# EAGLE schematic main (EAGLE 7.5.0)
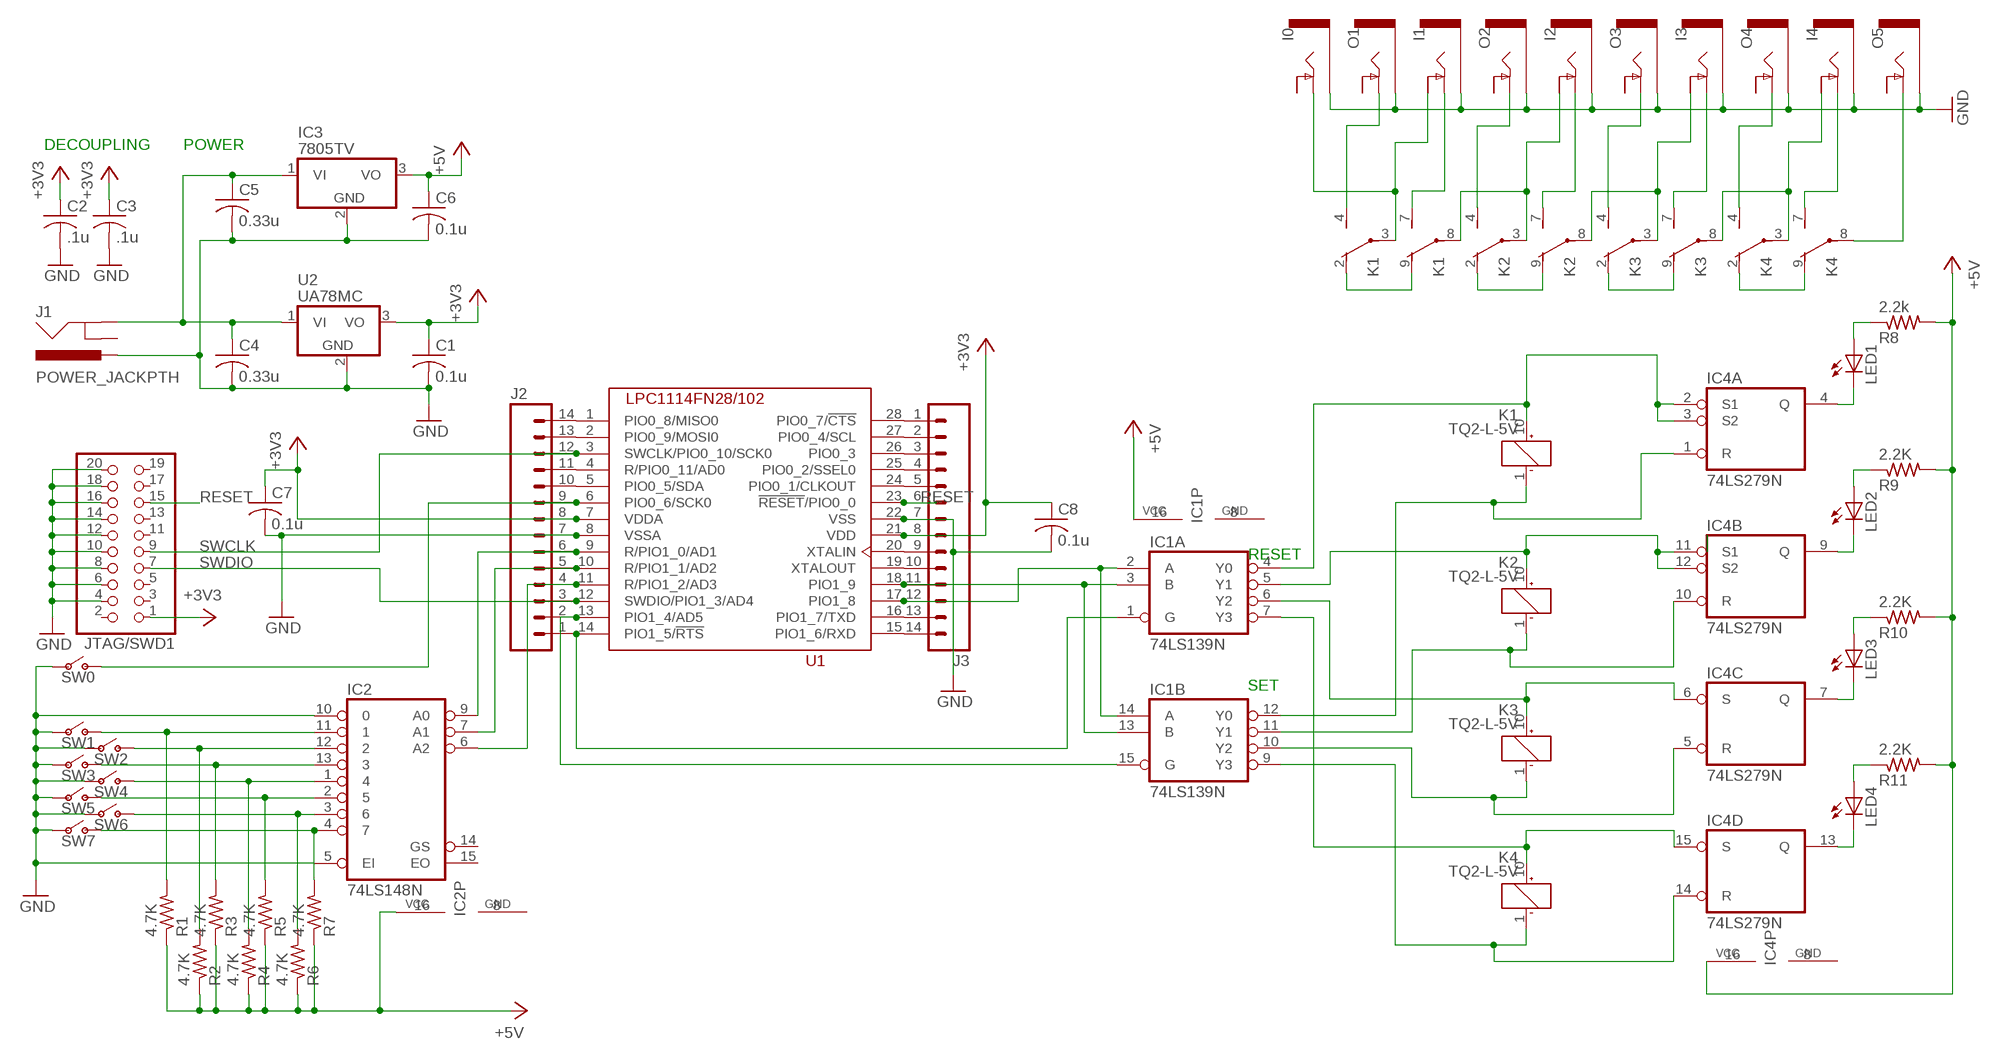
[diagram p0: schematic, sheet 1]

## Parts
C1  0.1u  C-US050-024X044  [C050-024X044]
C2  .1u  C-US050-024X044  [C050-024X044]
C3  .1u  C-US050-024X044  [C050-024X044]
C4  0.33u  C-US050-024X044  [C050-024X044]
C5  0.33u  C-US050-024X044  [C050-024X044]
C6  0.1u  C-US050-024X044  [C050-024X044]
C7  0.1u  C-US050-024X044  [C050-024X044]
C8  0.1u  C-US050-024X044  [C050-024X044]
I0  AUDIO-JACK-NORM-TS  [AUDIO-JACK-.25-INCH-SWCRAFT]
I1  AUDIO-JACK-NORM-TS  [AUDIO-JACK-.25-INCH-SWCRAFT]
I2  AUDIO-JACK-NORM-TS  [AUDIO-JACK-.25-INCH-SWCRAFT]
I3  AUDIO-JACK-NORM-TS  [AUDIO-JACK-.25-INCH-SWCRAFT]
I4  AUDIO-JACK-NORM-TS  [AUDIO-JACK-.25-INCH-SWCRAFT]
IC1  74LS139N  [DIL16]
IC2  74LS148N  [DIL16]
IC3  7805TV  [TO220V]
IC4  74LS279N  [DIL16]
J1  POWER_JACKPTH  [POWER_JACK_PTH]
J2  M14  [1X14]
J3  M14  [1X14]
JTAG/SWD1  PINHD-2X10  [2X10]
K1  TQ2-L-5V  [TQ2]
K2  TQ2-L-5V  [TQ2]
K3  TQ2-L-5V  [TQ2]
K4  TQ2-L-5V  [TQ2]
LED1  LED5MM  [LED5MM]
LED2  LED5MM  [LED5MM]
LED3  LED5MM  [LED5MM]
LED4  LED5MM  [LED5MM]
O1  AUDIO-JACK-NORM-TS  [AUDIO-JACK-.25-INCH-SWCRAFT]
O2  AUDIO-JACK-NORM-TS  [AUDIO-JACK-.25-INCH-SWCRAFT]
O3  AUDIO-JACK-NORM-TS  [AUDIO-JACK-.25-INCH-SWCRAFT]
O4  AUDIO-JACK-NORM-TS  [AUDIO-JACK-.25-INCH-SWCRAFT]
O5  AUDIO-JACK-NORM-TS  [AUDIO-JACK-.25-INCH-SWCRAFT]
R1  4.7K  R-US_0204/7  [0204/7]
R2  4.7K  R-US_0204/7  [0204/7]
R3  4.7K  R-US_0204/7  [0204/7]
R4  4.7K  R-US_0204/7  [0204/7]
R5  4.7K  R-US_0204/7  [0204/7]
R6  4.7K  R-US_0204/7  [0204/7]
R7  4.7K  R-US_0204/7  [0204/7]
R8  2.2k  R-US_0204/7  [0204/7]
R9  2.2K  R-US_0204/7  [0204/7]
R10  2.2K  R-US_0204/7  [0204/7]
R11  2.2K  R-US_0204/7  [0204/7]
SW0  SWITCH-SPST  [SWITCH_SPST_OFFBOARD]
SW1  SWITCH-SPST  [SWITCH_SPST_OFFBOARD]
SW2  SWITCH-SPST  [SWITCH_SPST_OFFBOARD]
SW3  SWITCH-SPST  [SWITCH_SPST_OFFBOARD]
SW4  SWITCH-SPST  [SWITCH_SPST_OFFBOARD]
SW5  SWITCH-SPST  [SWITCH_SPST_OFFBOARD]
SW6  SWITCH-SPST  [SWITCH_SPST_OFFBOARD]
SW7  SWITCH-SPST  [SWITCH_SPST_OFFBOARD]
U1  LPC1114FN28/102  [DIL28-6]
U2  UA78MC  [TO220V]

## Nets
+3V3: C1.1 C2.1 C3.1 C7.1 C8.1 J2.8 J3.8 JTAG/SWD1.1 U1.7(VDDA) U1.21(VDD) U2.3(VO)
+5V: C6.1 IC1.16(P:VCC) IC2.16(VCC) IC3.3(VO) IC4.16(P:VCC) R1.1 R2.1 R3.1 R4.1 R5.1 R6.1 R7.1 R8.2 R9.2 R10.2 R11.2
GND: C1.2 C2.2 C3.2 C4.2 C5.2 C6.2 C7.2 C8.2 I0.S I1.S I2.S I3.S I4.S IC2.5(EI) IC2.10 IC3.2(GND) J1.PWR J2.7 J3.7 JTAG/SWD1.4 JTAG/SWD1.6 JTAG/SWD1.8 JTAG/SWD1.10 JTAG/SWD1.12 JTAG/SWD1.14 JTAG/SWD1.16 JTAG/SWD1.18 JTAG/SWD1.20 O1.S O2.S O3.S O4.S O5.S SW0.3 SW1.3 SW2.3 SW3.3 SW4.3 SW5.3 SW6.3 SW7.3 U1.8(VSSA) U1.22(VSS) U2.2(GND)
N$1: J3.14 U1.15(PIO1_6/RXD)
N$2: C4.1 C5.1 IC3.1(VI) J1.GND U2.1(VI)
N$3: J3.13 U1.16(PIO1_7/TXD)
N$4: IC2.11 R1.2 SW1.2
N$5: IC1.3(A:B) IC1.13(B:B) J3.11 U1.18(PIO1_9)
N$6: IC1.15(B:G) J2.2 U1.13(PIO1_4/AD5)
N$7: IC1.1(A:G) J2.1 U1.14(PIO1_5/!RTS)
N$8: IC1.10(B:Y2) IC4.5(C:R) K3.1(_:-)
N$9: IC1.4(A:Y0) IC4.2(A:S1) IC4.3(A:S2) K1.10(_:+)
N$10: IC1.5(A:Y1) IC4.11(B:S1) IC4.12(B:S2) K2.10(_:+)
N$11: IC1.11(B:Y1) IC4.10(B:R) K2.1(_:-)
N$12: IC1.6(A:Y2) IC4.6(C:S) K3.10(_:+)
N$14: IC1.7(A:Y3) IC4.15(D:S) K4.10(_:+)
N$15: IC1.9(B:Y3) IC4.14(D:R) K4.1(_:-)
N$16: IC1.12(B:Y0) IC4.1(A:R) K1.1(_:-)
N$17: IC4.4(A:Q) LED1.K(C)
N$18: IC4.9(B:Q) LED2.K(C)
N$19: IC4.7(C:Q) LED3.K(C)
N$20: IC4.13(D:Q) LED4.K(C)
N$21: LED1.A R8.1
N$22: LED2.A R9.1
N$23: LED3.A R10.1
N$24: LED4.A R11.1
N$25: IC1.2(A:A) IC1.14(B:A) J3.12 U1.17(PIO1_8)
N$26: IC2.12 R2.2 SW2.2
N$27: IC2.13 R3.2 SW3.2
N$28: IC2.1 R4.2 SW4.2
N$29: IC2.2 R5.2 SW5.2
N$30: IC2.3 R6.2 SW6.2
N$31: IC2.4 R7.2 SW7.2
N$32: I0.T I1.TS K1.3(1:P)
N$33: K1.2(1:O) K1.9(2:O)
N$34: I1.T K1.7(2:S)
N$35: K1.4(1:S) O1.T
N$36: I2.TS K1.8(2:P) K2.3(1:P)
N$37: K2.2(1:O) K2.9(2:O)
N$38: K2.4(1:S) O2.T
N$39: I2.T K2.7(2:S)
N$40: I3.TS K2.8(2:P) K3.3(1:P)
N$41: K3.4(1:S) O3.T
N$42: K3.2(1:O) K3.9(2:O)
N$43: I3.T K3.7(2:S)
N$44: IC2.9(A0) J2.6 U1.9(R/PIO1_0/AD1)
N$45: I4.TS K3.8(2:P) K4.3(1:P)
N$46: K4.2(1:O) K4.9(2:O)
N$47: K4.4(1:S) O4.T
N$48: I4.T K4.7(2:S)
N$49: IC2.7(A1) J2.5 U1.10(R/PIO1_1/AD2)
N$50: K4.8(2:P) O5.T
N$51: IC2.6(A2) J2.4 U1.11(R/PIO1_2/AD3)
N$52: J2.9 SW0.2 U1.6(PIO0_6/SCK0)
N$53: J2.10 U1.5(PIO0_5/SDA)
N$54: J2.11 U1.4(R/PIO0_11/AD0)
N$55: J2.13 U1.2(PIO0_9/MOSI0)
N$56: J2.14 U1.1(PIO0_8/MISO0)
N$57: J3.1 U1.28(PIO0_7/!CTS)
N$58: J3.2 U1.27(PIO0_4/SCL)
N$59: J3.3 U1.26(PIO0_3)
N$60: J3.4 U1.25(PIO0_2/SSEL0)
N$61: J3.5 U1.24(PIO0_1/CLKOUT)
N$62: J3.9 U1.20(XTALIN)
N$63: J3.10 U1.19(XTALOUT)
RESET: J3.6 JTAG/SWD1.15 U1.23(!RESET!/PIO0_0)
SWCLK: J2.12 JTAG/SWD1.9 U1.3(SWCLK/PIO0_10/SCK0)
SWDIO: J2.3 JTAG/SWD1.7 U1.12(SWDIO/PIO1_3/AD4)
Unconnected: I0.TS IC2.14(GS) IC2.15(EO) J1.GNDBREAK JTAG/SWD1.2 JTAG/SWD1.3 JTAG/SWD1.5 JTAG/SWD1.11 JTAG/SWD1.13 JTAG/SWD1.17 JTAG/SWD1.19 O1.TS O2.TS O3.TS O4.TS O5.TS

## Notes on the sheet
- DECOUPLING | POWER
- RESET
- SET

## Power pins joined to a net without a drawn wire
GND: IC1.8(P:GND) IC2.8(GND) IC4.8(P:GND)

## Library data of the parts
C1-C8 = rcl:C-US: CAPACITOR, American symbol
I0 I1-I4 O1-O5 = SparkFun-Connectors:AUDIO-JACK-NORM-TS: Modeled after Switchcraft RN112APC.
IC1 = 74xx-us:74*139: Dual 2-line to 4-line DECODER/DEMULTIPLEXER
IC2 = 74xx-us:74*148: 10-line to 4-line and 8-line to 3-line PRIORITY ENCODER
IC3 = linear:78*: Positive VOLTAGE REGULATOR Source: http://cache.national.com/ds/LM/LM78L05.pdf http://www.fairchildsemi.com/ds/LM/LM7805.pdf
IC4 = 74xx-us:74*279: Quadruple S-R LATCH
J1 = SparkFun-Connectors:POWER_JACK: Power Jack This is the standard 5.5mm barrel jack for power. The PTH is the most common, proven, reliable, footprint. The Slot footprint only works if the mill layer is transmitted to the PCB fab house so be warned. Mating wall wart : TOL-00298 (and others); PROD_ID: CONN-08197
J2 J3 = SparkFun-Connectors:M14: Header 14 Standard 14-pin 0.1" header. Use with straight break away headers (SKU : PRT-00116), right angle break away headers (PRT-00553), swiss pins (PRT-00743), machine pins (PRT-00117), and female headers (PRT-00115).
JTAG/SWD1 = pinhead:PINHD-2X10: PIN HEADER
K1-K4 = relay:TQ2?*: LOW PROFILE 2 FORM C RELAY NAiS Source: http://www.mew-europe.com/.. en_ds_61020_0001.pdf Source: http://www.mew-europe.com/.. en_ds_61020_0004.pdf; MF: AROMAT/ MATSUSHITA; MPN: TQ2-L-5V; OC_FARNELL: 1448361; OC_NEWARK: 64K3191
LED1-LED4 = led:LED: LED OSRAM: - CHIPLED LG R971, LG N971, LY N971, LG Q971, LY Q971, LO R971, LY R971 LH N974, LH R974 LS Q976, LO Q976, LY Q976 LO Q996 - Hyper CHIPLED LW Q18S LB Q993, LB Q99A, LB R99A - SideLED LS A670, LO A670, LY A670, LG A670, LP A670 LB A673, LV A673, LT A673, LW A673 LH A674 LY A675 LS A676, LA A676, LO A676, LY A676, LW A676 LS A679, LY A679, LG A679 - Hyper Micro SIDELED® LS Y876, LA Y876, LO Y876, LY Y876 LT Y87S - SmartLED LW L88C, LW L88S LB L89C, LB L89S, LG L890 LS L89K, LO L89K, LY L89K LS L896, LA L896, LO L896, LY L896 - TOPLED LS T670, LO T670, LY T670, LG T670, LP T670 LSG T670, LSP T670, LSY T670, LOP T670, LYG T670 LG T671, LOG T671, LSG T671 LB T673, LV T673, LT T673, LW T673 LH T674 LS T676, LA T676, LO T676, LY T676, LB T676, LH T676, LSB T676, LW T676 LB T67C, LV T67C, LT T67C, LS T67K, LO T67K, LY T67K, LW E67C LS E67B, LA E67B, LO E67B, LY E67B, LB E67C, LV E67C, LT E67C LW T67C LS T679, LY T679, LG T679 LS T770, LO T770, LY T770, LG T770, LP T770 LB T773, LV T773, LT T773, LW T773 LH T774 LS E675, LA E675, LY E675, LS T675 LS T776, LA T776, LO T776, LY T776, LB T776 LHGB T686 LT T68C, LB T68C - Hyper Mini TOPLED® LB M676 - Mini TOPLED Santana® LG M470 LS M47K, LO M47K, LY M47K Source: http://www.osram.convergy.de LUXEON: - LUMILED® LXK2-PW12-R00, LXK2-PW12-S00, LXK2-PW14-U00, LXK2-PW14-V00 LXK2-PM12-R00, LXK2-PM12-S00, LXK2-PM14-U00 LXK2-PE12-Q00, LXK2-PE12-R00, LXK2-PE12-S00, LXK2-PE14-T00, LXK2-PE14-U00 LXK2-PB12-K00, LXK2-PB12-L00, LXK2-PB12-M00, LXK2-PB14-N00, LXK2-PB14-P00, LXK2-PB14-Q00 LXK2-PR12-L00, LXK2-PR12-M00, LXK2-PR14-Q00, LXK2-PR14-R00 LXK2-PD12-Q00, LXK2-PD12-R00, LXK2-PD12-S00 LXK2-PH12-R00, LXK2-PH12-S00 LXK2-PL12-P00, LXK2-PL12-Q00, LXK2-PL12-R00 Source: www.luxeon.com KINGBRIGHT: KA-3528ASYC Source: www.kingbright.com
R1-R11 = resistor:R-US_: RESISTOR, American symbol
SW0 SW1-SW7 = SparkFun-Switches:SWITCH-SPST
U1 = lpc_11xx:LPC1114FN28/102
U2 = lpc_11xx:UA78M*C